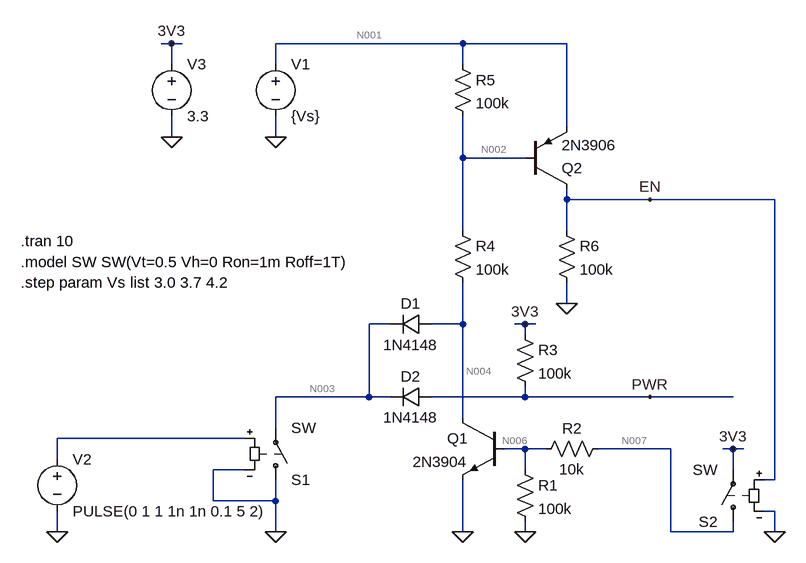
[diagram p0: schematic Power Button.asc]
Power Button.asc, the LTspice schematic file:
Version 4
SHEET 1 880 680
WIRE -272 -416 -288 -416
WIRE -256 -416 -272 -416
WIRE 176 -416 -112 -416
WIRE 336 -416 176 -416
WIRE -272 -384 -272 -416
WIRE -112 -384 -112 -416
WIRE 176 -384 176 -416
WIRE 336 -288 336 -416
WIRE -272 -272 -272 -304
WIRE -112 -272 -112 -304
WIRE 176 -240 176 -304
WIRE 272 -240 176 -240
WIRE 336 -176 336 -192
WIRE 464 -176 336 -176
WIRE 656 -176 464 -176
WIRE 176 -128 176 -240
WIRE 336 -128 336 -176
WIRE 336 -16 336 -48
WIRE 64 16 32 16
WIRE 176 16 176 -48
WIRE 176 16 128 16
WIRE 272 16 256 16
WIRE 288 16 272 16
WIRE 272 32 272 16
WIRE 32 128 32 16
WIRE 32 128 -112 128
WIRE 64 128 32 128
WIRE 272 128 272 112
WIRE 272 128 128 128
WIRE 464 128 272 128
WIRE 592 128 464 128
WIRE 176 160 176 16
WIRE -112 176 -112 128
WIRE -160 192 -448 192
WIRE 272 208 240 208
WIRE 304 208 272 208
WIRE 496 208 384 208
WIRE 592 208 576 208
WIRE 608 208 592 208
WIRE -448 224 -448 192
WIRE -160 240 -208 240
WIRE 272 240 272 208
WIRE 592 240 592 208
WIRE 656 256 656 -176
WIRE 656 256 640 256
WIRE -208 288 -208 240
WIRE -112 288 -112 256
WIRE -112 288 -208 288
WIRE 656 304 640 304
WIRE -448 336 -448 304
WIRE -112 336 -112 288
WIRE 176 336 176 256
WIRE 272 336 272 320
WIRE 496 336 496 208
WIRE 592 336 592 320
WIRE 592 336 496 336
WIRE 656 336 656 304
FLAG 272 336 0
FLAG 272 16 3V3
FLAG -112 336 0
FLAG 176 336 0
FLAG -112 -272 0
FLAG 336 -16 0
FLAG 464 -176 EN
FLAG -448 336 0
FLAG 656 336 0
FLAG 464 128 PWR
FLAG -272 -272 0
FLAG -272 -416 3V3
FLAG 592 208 3V3
SYMBOL npn 240 160 M0
SYMATTR InstName Q1
SYMATTR Value 2N3904
SYMBOL sw -112 272 M180
SYMATTR InstName S1
SYMBOL diode 128 0 R90
WINDOW 0 0 32 VBottom 2
WINDOW 3 32 32 VTop 2
SYMATTR InstName D1
SYMATTR Value 1N4148
SYMBOL diode 128 112 R90
WINDOW 0 0 32 VBottom 2
WINDOW 3 32 32 VTop 2
SYMATTR InstName D2
SYMATTR Value 1N4148
SYMBOL res 256 224 R0
SYMATTR InstName R1
SYMATTR Value 100k
SYMBOL res 400 192 R90
WINDOW 0 0 56 VBottom 2
WINDOW 3 32 56 VTop 2
SYMATTR InstName R2
SYMATTR Value 10k
SYMBOL res 256 16 R0
SYMATTR InstName R3
SYMATTR Value 100k
SYMBOL res 160 -144 R0
SYMATTR InstName R4
SYMATTR Value 100k
SYMBOL res 160 -400 R0
SYMATTR InstName R5
SYMATTR Value 100k
SYMBOL voltage -112 -400 R0
WINDOW 123 0 0 Left 0
WINDOW 39 0 0 Left 0
SYMATTR InstName V1
SYMATTR Value {Vs}
SYMBOL pnp 272 -192 M180
SYMATTR InstName Q2
SYMATTR Value 2N3906
SYMBOL res 320 -144 R0
SYMATTR InstName R6
SYMATTR Value 100k
SYMBOL voltage -448 208 R0
WINDOW 123 0 0 Left 0
WINDOW 39 0 0 Left 0
SYMATTR InstName V2
SYMATTR Value PULSE(0 1 1 1n 1n 0.1 5 2)
SYMBOL voltage -272 -400 R0
WINDOW 123 0 0 Left 0
WINDOW 39 0 0 Left 0
SYMATTR InstName V3
SYMATTR Value 3.3
SYMBOL sw 592 336 R180
SYMATTR InstName S2
TEXT -504 -112 Left 2 !.tran 10
TEXT -504 -80 Left 2 !.model SW SW(Vt=0.5 Vh=0 Ron=1m Roff=1T)
TEXT -504 -48 Left 2 !.step param Vs list 3.0 3.7 4.2

The netlist it stands for:
* Power Button.asc
Q1 N004 N006 0 0 2N3904
S1 0 N003 N005 0 SW
D1 N004 N003 1N4148
D2 PWR N003 1N4148
R1 N006 0 100k
R2 N007 N006 10k
R3 3V3 PWR 100k
R4 N002 N004 100k
R5 N001 N002 100k
V1 N001 0 {Vs}
Q2 EN N002 N001 0 2N3906
R6 EN 0 100k
V2 N005 0 PULSE(0 1 1 1n 1n 0.1 5 2)
V3 3V3 0 3.3
S2 N007 3V3 EN 0 SW
.model D D
.lib standard.dio
.model NPN NPN
.model PNP PNP
.lib standard.bjt
.tran 10
.model SW SW(Vt=0.5 Vh=0 Ron=1m Roff=1T)
.step param Vs list 3.0 3.7 4.2
.backanno
.end

* Results of the author's LTspice run, read from the files saved beside the schematic
* Operating Point (first step), zero values left out:
*   vs = 3 
*   V(n004) = 3.001 V
*   V(n006) = 960.3 nV
*   V(n003) = 3.268 V
*   V(pwr) = 3.3 V
*   V(n007) = 1.026 µV
*   V(3v3) = 3.3 V
*   V(n002) = 3 V
*   V(n001) = 3 V
*   V(en) = 301.3 nV
*   Ic(Q1) = 3.013 pA
*   Ib(Q1) = -3.003 pA
*   Ic(Q2) = -3.013 pA
*   Ib(Q2) = 3.003 pA
*   I(D1) = -2.513 nA
*   I(D2) = 2.52 nA
*   I(R1) = 9.603 pA
*   I(R2) = 6.6 pA
*   I(R3) = 2.52 nA
*   I(R4) = -2.51 nA
*   I(R5) = -2.507 nA
*   I(R6) = 3.013 pA
*   I(S1) = 6.537 pA
*   I(S2) = 6.6 pA
*   I(V1) = 2.507 nA
*   I(V3) = -2.527 nA
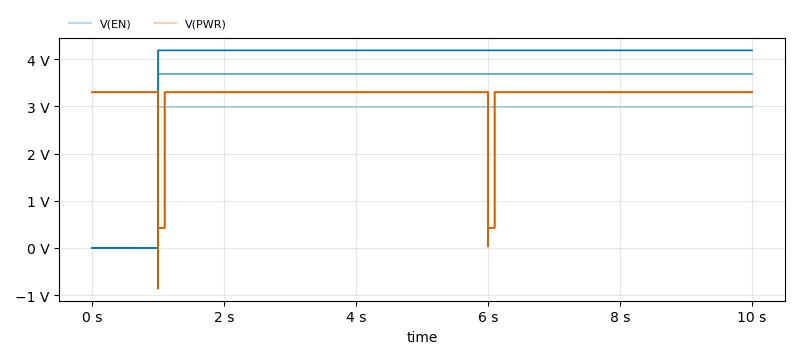
[diagram p1: Transient Analysis of Power Button.asc, plotted from the saved traces]
* Transient Analysis, 3 runs:
*   V(EN) [vs=3]: min -256 mV, max 2.987 V, average 2.688 V, rms 2.833 V, last 2.987 V
*   V(EN) [vs=3.7]: min -292.8 mV, max 3.687 V, average 3.319 V, rms 3.498 V, last 3.687 V
*   V(EN) [vs=4.2]: min -311 mV, max 4.188 V, average 3.769 V, rms 3.973 V, last 4.188 V
*   V(PWR) [vs=3]: min 31.31 mV, max 3.3 V, average 3.242 V, rms 3.267 V, last 3.3 V
*   V(PWR) [vs=3.7]: min -367.9 mV, max 3.3 V, average 3.242 V, rms 3.267 V, last 3.3 V
*   V(PWR) [vs=4.2]: min -867.9 mV, max 3.3 V, average 3.242 V, rms 3.267 V, last 3.3 V